# Altium schematic sheet Connectors.SchDoc
size A4
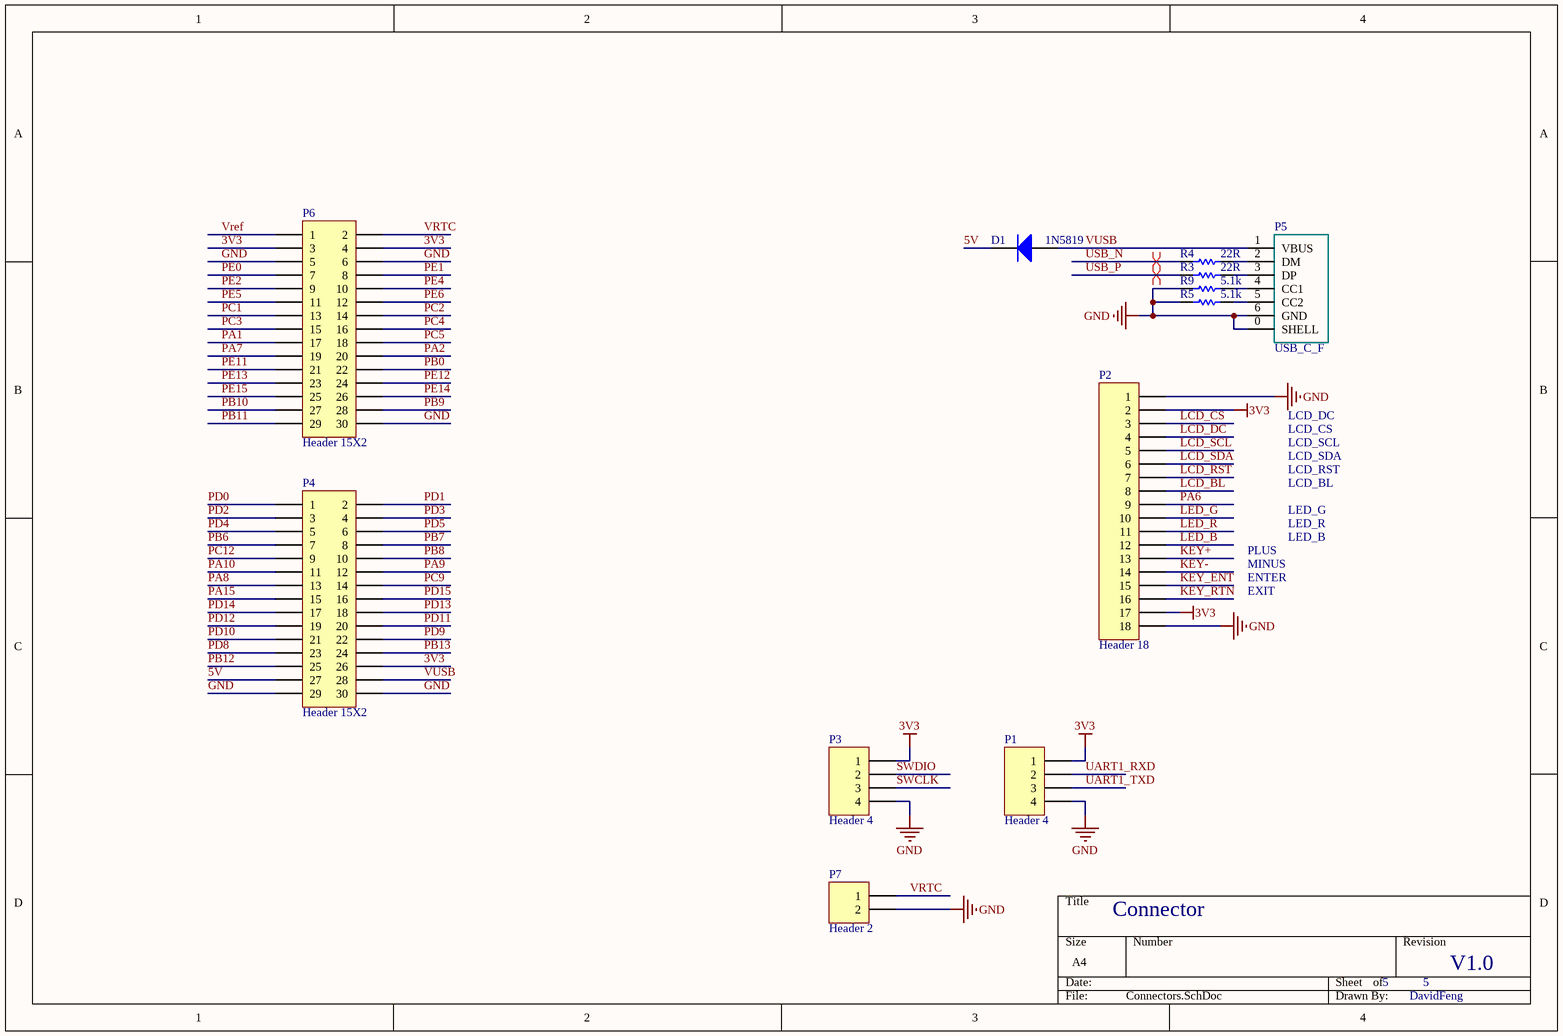
[diagram p0: Connectors.SchDoc]

## Parts
D1  1N5819  [SOD-123]
P1  Header 4  [SH1.27-4SW]
P2  Header 18  [FPC18-0.5]
P3  Header 4  [SH1.27-4SW]
P4  Header 15X2  [HDRH2.0-2X15]
P5  USB_C_F  [USB Type-C-F]
P6  Header 15X2  [HDRH2.0-2X15]
P7  Header 2  [SH-1.27-2AW]
R3  22R  [R0603]
R4  22R  [R0603]
R5  5.1k  [R0603]
R9  5.1k  [R0603]

## Nets
3V3: P1.1 P2.2 P2.17 P3.1 P4.26 P6.3 P6.4
GND: P1.4 P2.1 P2.18 P3.4 P4.29 P4.30 P5.0(SHELL) P5.6(GND) P6.5 P6.6 P6.30 P7.2 R5.1 R9.1
5V: D1.2(K) P4.27
KEY+: P2.13
KEY-: P2.14
KEY_ENT: P2.15
KEY_RTN: P2.16
LCD_BL: P2.8
LCD_CS: P2.3
LCD_DC: P2.4
LCD_RST: P2.7
LCD_SCL: P2.5
LCD_SDA: P2.6
LED_B: P2.12
LED_G: P2.10
LED_R: P2.11
PA1: P6.17
PA2: P6.20
PA6: P2.9
PA7: P6.19
PA8: P4.13
PA9: P4.12
PA10: P4.11
PA15: P4.15
PB0: P6.22
PB6: P4.7
PB7: P4.8
PB8: P4.10
PB9: P6.28
PB10: P6.27
PB11: P6.29
PB12: P4.25
PB13: P4.24
PC1: P6.13
PC2: P6.14
PC3: P6.15
PC4: P6.16
PC5: P6.18
PC9: P4.14
PC12: P4.9
PD0: P4.1
PD1: P4.2
PD2: P4.3
PD3: P4.4
PD4: P4.5
PD5: P4.6
PD8: P4.23
PD9: P4.22
PD10: P4.21
PD11: P4.20
PD12: P4.19
PD13: P4.18
PD14: P4.17
PD15: P4.16
PE0: P6.7
PE1: P6.8
PE2: P6.9
PE4: P6.10
PE5: P6.11
PE6: P6.12
PE11: P6.21
PE12: P6.24
PE13: P6.23
PE14: P6.26
PE15: P6.25
SWCLK: P3.3
SWDIO: P3.2
UART1_RXD: P1.2
UART1_TXD: P1.3
USB_N: R4.1
USB_P: R3.1
Vref: P6.1
VRTC: P6.2 P7.1
VUSB: D1.1(A) P4.28 P5.1(VBUS)
NetP5_2: P5.2(DM) R4.2
NetP5_3: P5.3(DP) R3.2
NetP5_4: P5.4(CC1) R9.2
NetP5_5: P5.5(CC2) R5.2

## Layout directives
differential pair: USB_N, USB_P

## Notes on the sheet
- LCD_DC
- LCD_CS
- LCD_SCL
- LCD_SDA
- LCD_RST
- LCD_BL
- LED_G
- PLUS
- MINUS
- ENTER
- LED_R
- LED_B
- EXIT
- Connector
- 5
- V1.0
- DavidFeng

## Library data of the parts
D1 = Diode: Default Diode; Published: 8-Jun-2000; LatestRevisionDate: 17-Jul-2002; LatestRevisionNote: Re-released for DXP Platform.; PackageVersion: Sep-1996; PackageReference: SMC; Publisher: Altium Limited; Code_JEDEC: DO-214-AB
P1 P3 = Header 4: Header, 4-Pin; LatestRevisionDate: 17-Jul-2002; LatestRevisionNote: Re-released for DXP Platform.; Publisher: Altium Limited
P2 = Header 18: Header, 18-Pin; LatestRevisionDate: 17-Jul-2002; LatestRevisionNote: Re-released for DXP Platform.; Publisher: Altium Limited
P4 P6 = Header 15X2: Header, 15-Pin, Dual row; LatestRevisionDate: 17-Jul-2002; LatestRevisionNote: Re-released for DXP Platform.; Publisher: Altium Limited
P7 = Header 2: Header, 2-Pin; LatestRevisionDate: 17-Jul-2002; LatestRevisionNote: Re-released for DXP Platform.; Publisher: Altium Limited
R3-R5 R9 = Res1: Resistor; Value: 22; Published: 8-Jun-2000; LatestRevisionDate: 17-Jul-2002; LatestRevisionNote: Re-released for DXP Platform.; PackageReference: AXIAL-0.3; Publisher: Altium Limited